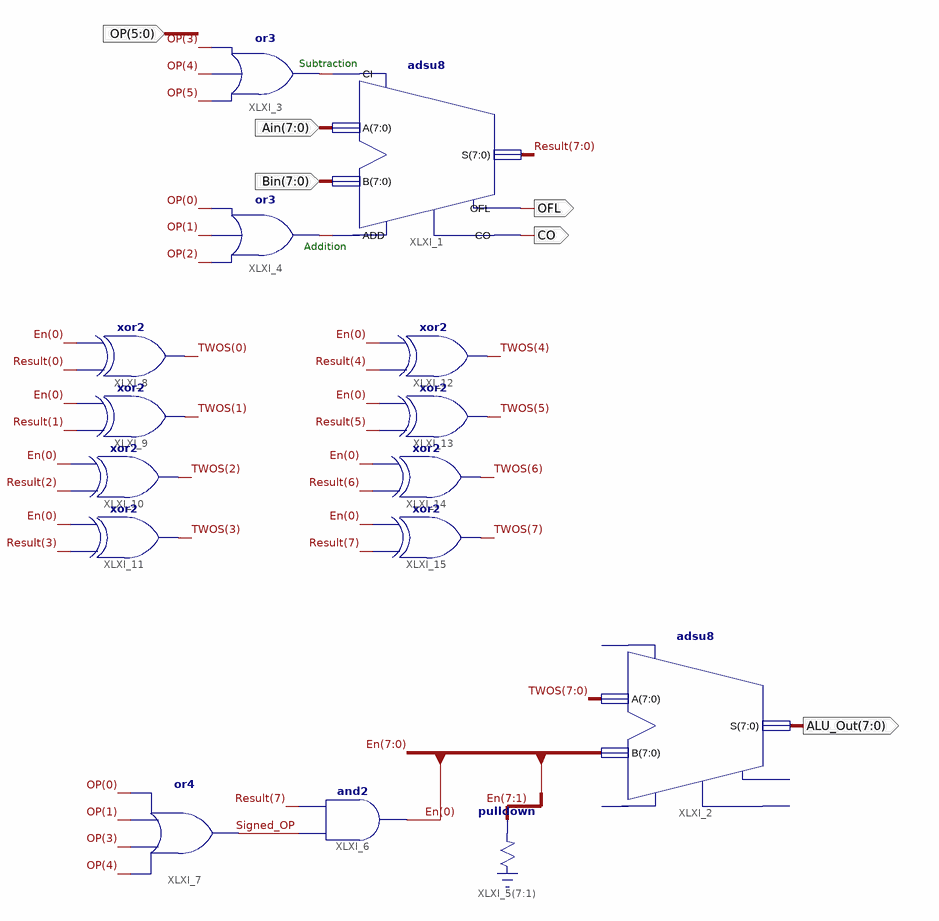
[diagram p0: schematic sheet 1]
// Xilinx ISE schematic ALU_Module.sch (spartan3e) as structural Verilog: 15 symbols, 6 ports
module ALU_Module (
  input  [7:0] Ain,
  input  [7:0] Bin,
  input  [5:0] OP,
  output CO,
  output [7:0] ALU_Out,
  output OFL
);

  wire Signed_OP, XLXN_1, XLXN_2;
  wire [7:0] En, Result, TWOS;

  adsu8 XLXI_1 (.A(Ain), .ADD(XLXN_2), .B(Bin), .CI(XLXN_1), .CO(CO), .OFL(OFL), .S(Result));
  adsu8 XLXI_2 (.A(TWOS), .B(En), .S(ALU_Out));  // open: ADD, CI, CO, OFL
  or XLXI_3 (XLXN_1, OP[5], OP[4], OP[3]);
  or XLXI_4 (XLXN_2, OP[2], OP[1], OP[0]);
  \pulldown  XLXI_5[7:1] (.O(En[7:1]));
  and XLXI_6 (En[0], Signed_OP, Result[7]);
  or XLXI_7 (Signed_OP, OP[4], OP[3], OP[1], OP[0]);
  xor XLXI_8 (TWOS[0], Result[0], En[0]);
  xor XLXI_9 (TWOS[1], Result[1], En[0]);
  xor XLXI_10 (TWOS[2], Result[2], En[0]);
  xor XLXI_11 (TWOS[3], Result[3], En[0]);
  xor XLXI_12 (TWOS[4], Result[4], En[0]);
  xor XLXI_13 (TWOS[5], Result[5], En[0]);
  xor XLXI_14 (TWOS[6], Result[6], En[0]);
  xor XLXI_15 (TWOS[7], Result[7], En[0]);

  // Notes on the sheet:
  //   Subtraction
  //   Addition
endmodule
